# EAGLE design marlin_interface (EAGLE 9.6.0)
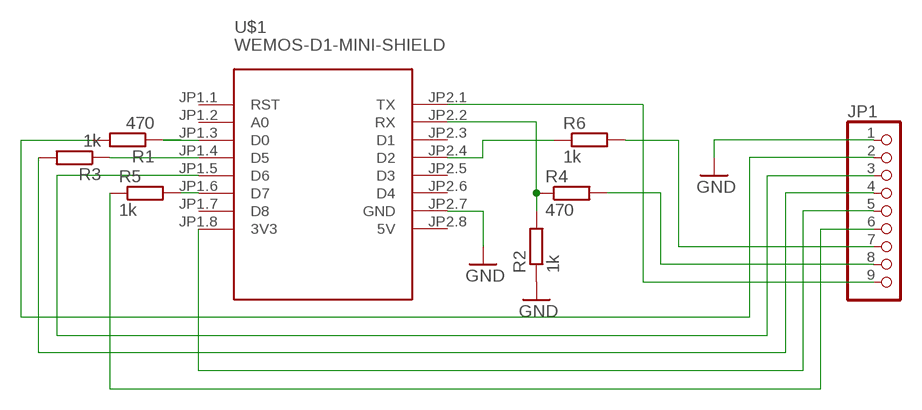
[diagram p0: schematic, sheet 1]

## Parts
JP1  PINHD-1X9/90  [1X09/90]
R1  470  R-EU_0204/5  [0204/5]
R2  1k  R-EU_0204/5  [0204/5]
R3  1k  R-EU_0204/5  [0204/5]
R4  470  R-EU_0204/5  [0204/5]
R5  1k  R-EU_0204/5  [0204/5]
R6  1k  R-EU_0204/5  [0204/5]
U$1  WEMOS-D1-MINI-SHIELD  [WEMOS-D1-MINI-SHIELD]

## Nets
GND: JP1.1 R2.1 U$1.JP2.7(GND)
N$1: JP1.9 U$1.JP2.1(TX)
N$2: JP1.3 U$1.JP1.5(D6)
N$3: JP1.8 R4.2
N$4: JP1.5 U$1.JP1.8(3V3)
N$5: JP1.2 R1.2
N$6: R1.1 U$1.JP1.3(D0)
N$7: R2.2 R4.1 U$1.JP2.2(RX)
N$8: JP1.4 R3.2
N$10: R5.2 U$1.JP1.6(D7)
N$11: JP1.6 R5.1
N$12: R6.1 U$1.JP2.4(D2)
N$13: JP1.7 R6.2
N$14: R3.1 U$1.JP1.4(D5)
Unconnected: U$1.JP1.1(RST) U$1.JP1.2(A0) U$1.JP1.7(D8) U$1.JP2.3(D1) U$1.JP2.5(D3) U$1.JP2.6(D4)

## Power pins joined to a net without a drawn wire
5V: U$1.JP2.8(5V)

## Library data of the parts
JP1 = pinhead:PINHD-1X9: PIN HEADER
R1-R6 = resistor:R-EU_: RESISTOR, European symbol
U$1 = diy-modules:WEMOS-D1-MINI-SHIELD: Template for WEMOS D1 mini compatible shields NOTICE: This is a template only. You can use it as a base to create symbols for WEMOS D1 mini compatible shields. Official list of available shields can be found here: https://www.wemos.cc/D1-mini-Shields

## Board
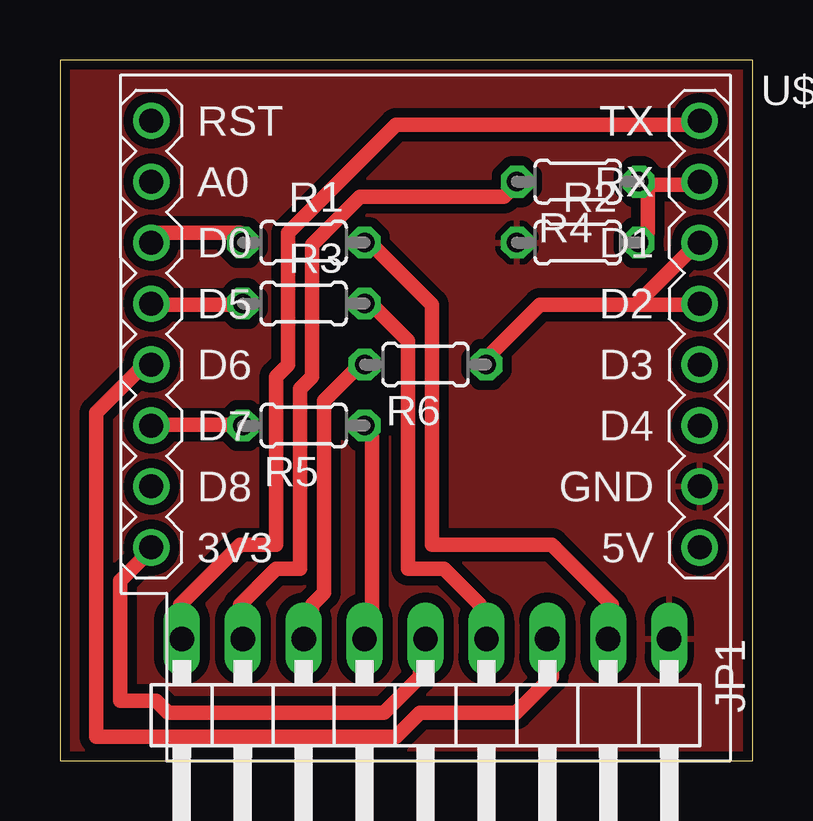
[diagram p1: board, top side]

Size 28.88 x 29.2 mm. Coordinates in mm from the lower left corner, seen from the top.
Outline: 0,0 28.88,0 28.88,29.2 0,29.2 0,0
Copper layers (1*16): Top 0.035mm / dielectric 2mm / Bottom 0.035mm
Design rules "corexy_DRC *": minimum track width 0.6mm, minimum drill 0.9mm, track to track 0.4mm, track to pad 0.4mm, pad to pad 0.4mm, via to via 0.4mm, smd to smd 0.4mm, copper to edge 0.4mm, drill to drill 0.4mm, minimum pad ring 10mil, minimum via ring 8mil, stop-mask expansion 4mil, vias tented up to drill 0mil, thermal gap 10mil

### Footprints (pad centres in the part's own frame; a part is rotated, then mirrored left to right if it is on the bottom)
1X09/90 = drill 1.016 long: 1 -10.16,-3.81; 2 -7.62,-3.81; 3 -5.08,-3.81; 4 -2.54,-3.81; 5 0,-3.81; 6 2.54,-3.81; 7 5.08,-3.81; 8 7.62,-3.81; 9 10.16,-3.81
0204/5 = drill 0.813 octagon: 1 -2.54,0; 2 2.54,0
WEMOS-D1-MINI-SHIELD = drill 1: JP1.1 -11.43,12.065; JP1.2 -11.43,9.525; JP1.3 -11.43,6.985; JP1.4 -11.43,4.445; JP1.5 -11.43,1.905; JP1.6 -11.43,-0.635; JP1.7 -11.43,-3.175; JP1.8 -11.43,-5.715; JP2.1 11.43,12.065; JP2.2 11.43,9.525; JP2.3 11.43,6.985; JP2.4 11.43,4.445; JP2.5 11.43,1.905; JP2.6 11.43,-0.635; JP2.7 11.43,-3.175; JP2.8 11.43,-5.715

### Placement (x,y rotation side)
JP1  15.24,1.27 180 top
R1  10.16,21.59 0 top
R2  21.59,21.59 0 top
R3  10.16,19.05 0 top
R4  21.59,24.13 180 top
R5  10.16,13.97 180 top
R6  15.24,16.51 180 top
U$1  15.24,14.61 0 top

### Tracks (layer width: path | path; a pad name or v marks a point on that pad's centre or on a via)
GND
  pour Top: -1.27,29.21 29.21,29.21 29.21,-1.27 -1.27,-1.27
N$1
  Top 0.6: U$1.JP2.1 26.5,26.5 14,26.5 9.5,22 9.5,16.5 9,16 9,9 7.5,9 5,6.5 5,5.5 JP1.9
N$2
  Top 0.6: U$1.JP1.5 3.5,16.5 1.5,14.5 1.5,1 14,1 15,2 19,2 20.5,3.5 20.5,5 JP1.3
N$3
  Top 0.6: R4.2 19,24 18.5,23.5 12.5,23.5 10.5,21.5 10.5,16 10,15.5 10,8 9,8 7.5,6.5 7.5,5.5 JP1.8
N$4
  Top 0.6: U$1.JP1.8 3.5,8.5 2.5,7.5 2.5,2.5 4,2.5 4.5,2 13.5,2 15,3.5 15,5 JP1.5
N$5
  Top 0.6: R1.2 13,21.5 15.5,19 15.5,9 20.5,9 23,6.5 23,5.5 JP1.2
N$6
  Top 0.6: R1.1 7.5,22 4,22 U$1.JP1.3
N$7
  Top 0.6: 24.5,24 24.5,22 R2.2 | 24.5,24 26.5,24 U$1.JP2.2 | 24.5,24 R4.1
N$8
  Top 0.6: R3.2 13,19 14.5,17.5 14.5,8 16,8 17.5,6.5 17.5,5.5 JP1.4
N$10
  Top 0.6: R5.2 7.5,14 4,14 U$1.JP1.6
N$11
  Top 0.6: R5.1 13,13.5 13,5.5 JP1.6
N$12
  Top 0.6: 24,19 26.5,19 U$1.JP2.4 | 24,19 20,19 18,17 R6.1 | 24,19 26.5,21.5
N$13
  Top 0.6: R6.2 12.5,16.5 11,15 11,7 10.5,6.5 10.5,5.5 JP1.7
N$14
  Top 0.6: R3.1 7.5,19 4,19 U$1.JP1.4